# Altium project 1819_Emmeteur_DCF.PrjPCB
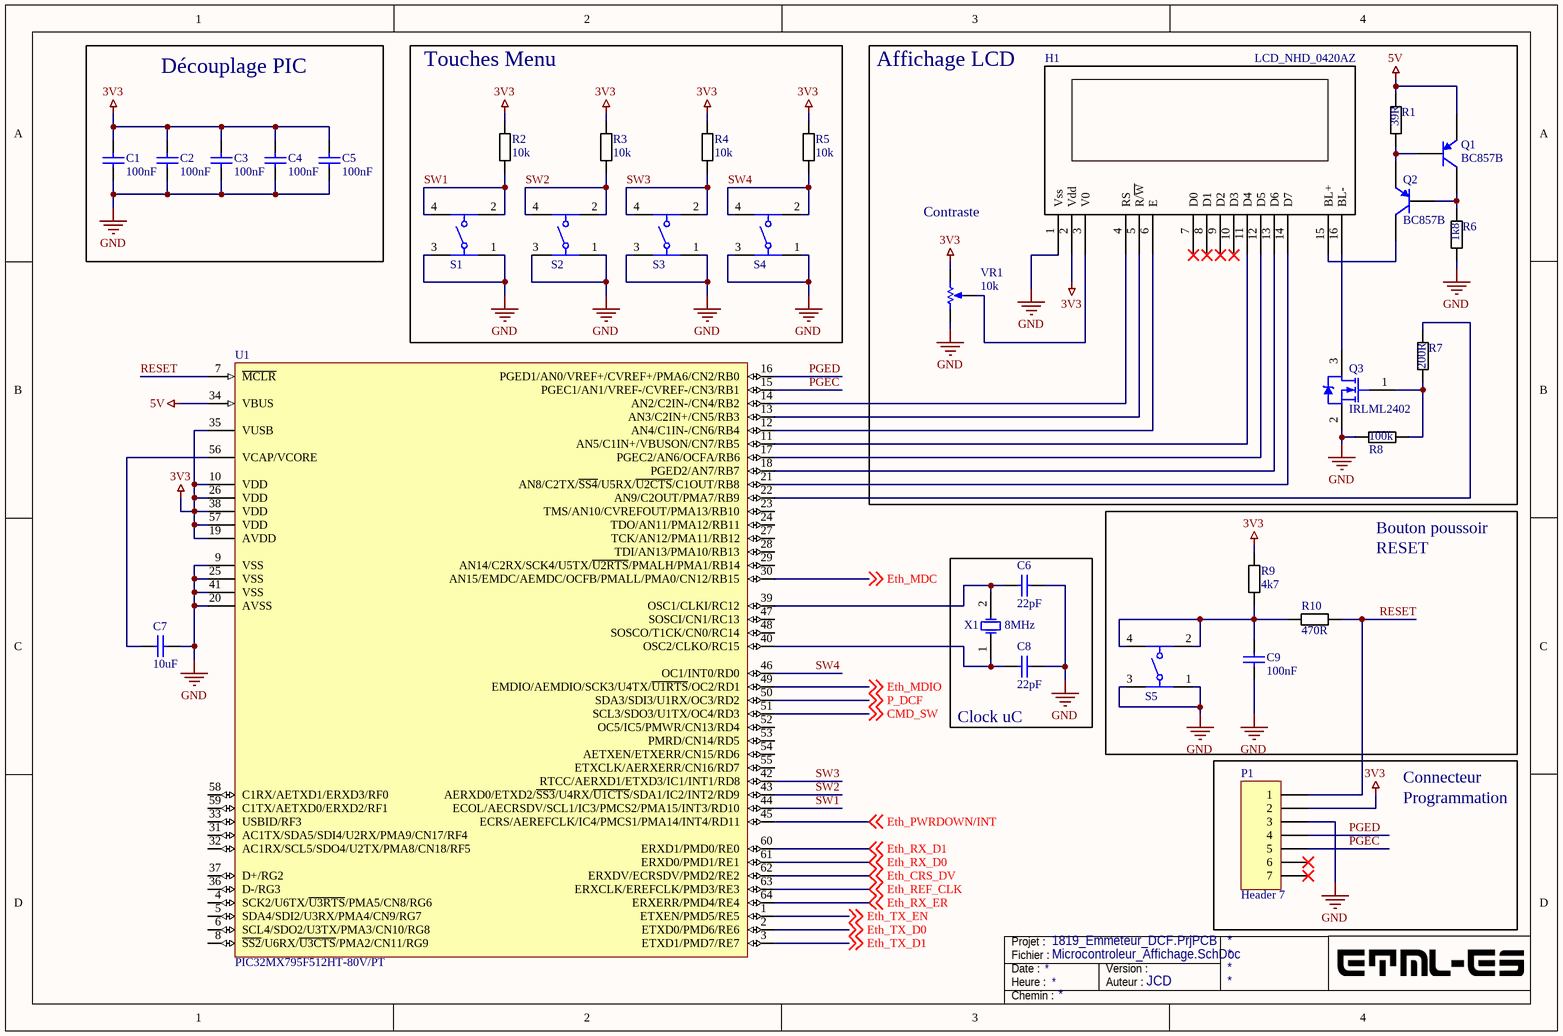
[diagram p0: Microcontroleur_Affichage.SchDoc]
2 sheets, 69 parts. Net scope: global (net labels, ports and power ports of the same name join across sheets).
Board file: 1819_Emmeteur_DCF.PcbDoc
Sheets:
  Microcontroleur_Affichage.SchDoc
  DCF_ALIM_SWITCH_RESET.SchDoc

## Sheet Microcontroleur_Affichage.SchDoc
size A4; Author: JCD

### Parts
C1  100nF  [C0805]
C2  100nF  [C0805]
C3  100nF  [C0805]
C4  100nF  [C0805]
C5  100nF  [C0805]
C6  22pF  [C0805]
C7  10uF  [C0805]
C8  22pF  [C0805]
C9  100nF  [C0805]
H1  LCD_NHD_0420AZ  [NHD-0420AZ-FSW-GBW-33V3]
P1  Header 7  [HDR1X7]
Q1  BC857B  [INF-SOT23_L]
Q2  BC857B  [INF-SOT23_L]
Q3  IRLML2402  [INTR-IRLML2402TRPBF-3_V]
R1  39R  [RESC0805(2012)_L]
R2  10k  [RESC0805(2012)_L]
R3  10k  [RESC0805(2012)_L]
R4  10k  [RESC0805(2012)_L]
R5  10k  [RESC0805(2012)_L]
R6  1k8  [RESC0805(2012)_L]
R7  200R  [RESC0805(2012)_L]
R8  100k  [RESC0805(2012)_L]
R9  4k7  [RESC0805(2012)_L]
R10  470R  [RESC0805(2012)_L]
S1  430152095836  [430152095836]  (value not drawn)
S2  430152095836  [430152095836]  (value not drawn)
S3  430152095836  [430152095836]  (value not drawn)
S4  430152095836  [430152095836]  (value not drawn)
S5  430152043836  [430152043836]  (value not drawn)
U1  PIC32MX795F512HT-80V/PT  [TQFP-PT64_L]
VR1  10k  [BOUR-3362P]
X1  8MHz  [ECS-80-18-5PX-TR_V]

### Blocks framed on the sheet
Découplage PIC: C1-C5
Touches Menu: R2-R5 S1-S4
Affichage LCD: H1 Q1-Q3 R1 R6-R8 VR1
Clock uC: C6 C8 X1

### Nets
3V3: C1.2 C2.2 C3.2 C4.2 C5.2 H1.2(Vdd) P1.2 R2.1 R3.1 R4.1 R5.1 R9.1 U1.10(VDD) U1.19(AVDD) U1.26(VDD) U1.35(VUSB) U1.38(VDD) U1.57(VDD) VR1.3(CW)
5V: Q1.2(E) R1.2 U1.34(VBUS)
GND: C1.1 C2.1 C3.1 C4.1 C5.1 C6.2 C7.2 C8.2 C9.1 H1.1(Vss) P1.3 Q3.2(S) R6.1 R8.1 S1.1 S1.3 S2.1 S2.3 S3.1 S3.3 S4.1 S4.3 S5.1 S5.3 U1.9(VSS) U1.20(AVSS) U1.25(VSS) U1.41(VSS) VR1.1(CCW)
CMD_SW: U1.51(SCL3/SDO3/U1TX/OC4/RD3) ; off-sheet CMD_SW
Eth_CRS_DV: U1.62(ERXDV/ECRSDV/PMD2/RE2) ; off-sheet Eth_CRS_DV
Eth_MDC: U1.30(AN15/EMDC/AEMDC/OCFB/PMALL/PMA0/CN12/RB15) ; off-sheet Eth_MDC
Eth_MDIO: U1.49(EMDIO/AEMDIO/SCK3/U4TX/~{U1RTS}/OC2/RD1) ; off-sheet Eth_MDIO
Eth_PWRDOWN/INT: U1.45(ECRS/AEREFCLK/IC4/PMCS1/PMA14/INT4/RD11) ; off-sheet Eth_PWRDOWN/INT
Eth_REF_CLK: U1.63(ERXCLK/EREFCLK/PMD3/RE3) ; off-sheet Eth_REF_CLK
Eth_RX_D0: U1.61(ERXD0/PMD1/RE1) ; off-sheet Eth_RX_D0
Eth_RX_D1: U1.60(ERXD1/PMD0/RE0) ; off-sheet Eth_RX_D1
Eth_RX_ER: U1.64(ERXERR/PMD4/RE4) ; off-sheet Eth_RX_ER
Eth_TX_D0: U1.2(ETXD0/PMD6/RE6) ; off-sheet Eth_TX_D0
Eth_TX_D1: U1.3(ETXD1/PMD7/RE7) ; off-sheet Eth_TX_D1
Eth_TX_EN: U1.1(ETXEN/PMD5/RE5) ; off-sheet Eth_TX_EN
P_DCF: U1.50(SDA3/SDI3/U1RX/OC3/RD2) ; off-sheet P_DCF
PGEC: P1.5 U1.15(PGEC1/AN1/VREF-/CVREF-/CN3/RB1)
PGED: P1.4 U1.16(PGED1/AN0/VREF+/CVREF+/PMA6/CN2/RB0)
RESET: P1.1 R10.2 U1.7(~{MCLR})
SW1: R2.2 S1.2 S1.4 U1.44(ECOL/AECRSDV/SCL1/IC3/PMCS2/PMA15/INT3/RD10)
SW2: R3.2 S2.2 S2.4 U1.43(AERXD0/ETXD2/~{SS3}/U4RX/~{U1CTS}/SDA1/IC2/INT2/RD9)
SW3: R4.2 S3.2 S3.4 U1.42(RTCC/AERXD1/ETXD3/IC1/INT1/RD8)
SW4: R5.2 S4.2 S4.4 U1.46(OC1/INT0/RD0)
NetC6_1: C6.1 U1.39(OSC1/CLKI/RC12) X1.2(X2)
NetC7_1: C7.1 U1.56(VCAP/VCORE)
NetC8_1: C8.1 U1.40(OSC2/CLKO/RC15) X1.1(X1)
NetC9_2: C9.2 R9.2 R10.1 S5.2 S5.4
NetH1_3: H1.3(V0) VR1.2(S)
NetH1_4: H1.4(RS) U1.14(AN2/C2IN-/CN4/RB2)
NetH1_5: H1.5(R/~{W}) U1.13(AN3/C2IN+/CN5/RB3)
NetH1_6: H1.6(E) U1.12(AN4/C1IN-/CN6/RB4)
NetH1_11: H1.11(D4) U1.11(AN5/C1IN+/VBUSON/CN7/RB5)
NetH1_12: H1.12(D5) U1.17(PGEC2/AN6/OCFA/RB6)
NetH1_13: H1.13(D6) U1.18(PGED2/AN7/RB7)
NetH1_14: H1.14(D7) U1.21(AN8/C2TX/~{SS4}/U5RX/~{U2CTS}/C1OUT/RB8)
NetH1_15: H1.15(BL+) Q2.3(C)
NetH1_16: H1.16(BL-) Q3.3(D)
NetQ1_1: Q1.1(B) Q2.2(E) R1.1
NetQ1_3: Q1.3(C) Q2.1(B) R6.2
NetQ3_1: Q3.1(G) R7.1 R8.2
NetR7_2: R7.2 U1.22(AN9/C2OUT/PMA7/RB9)

Not connected (* = marked no-connect by the designer): H1 7(D0)* 8(D1)* 9(D2)* 10(D3)*; P1 6* 7*; U1 4(SCK2/U6TX/~{U3RTS}/PMA5/CN8/RG6) 5(SDA4/SDI2/U3RX/PMA4/CN9/RG7) 6(SCL4/SDO2/U3TX/PMA3/CN10/RG8) 8(~{SS2}/U6RX/~{U3CTS}/PMA2/CN11/RG9) 23(TMS/AN10/CVREFOUT/PMA13/RB10) 24(TDO/AN11/PMA12/RB11) 27(TCK/AN12/PMA11/RB12) 28(TDI/AN13/PMA10/RB13) 29(AN14/C2RX/SCK4/U5TX/~{U2RTS}/PMALH/PMA1/RB14) 31(AC1TX/SDA5/SDI4/U2RX/PMA9/CN17/RF4) 32(AC1RX/SCL5/SDO4/U2TX/PMA8/CN18/RF5) 33(USBID/RF3) 36(D-/RG3) 37(D+/RG2) 47(SOSCI/CN1/RC13) 48(SOSCO/T1CK/CN0/RC14) 52(OC5/IC5/PMWR/CN13/RD4) 53(PMRD/CN14/RD5) 54(AETXEN/ETXERR/CN15/RD6) 55(ETXCLK/AERXERR/CN16/RD7) 58(C1RX/AETXD1/ERXD3/RF0) 59(C1TX/AETXD0/ERXD2/RF1)

### Notes on the sheet
- Contraste
- Bouton poussoir
- RESET
- Connecteur
- Programmation
- Fichier :
- Date :
- Heure :
- Projet :
- Auteur :
- Version :
- Chemin :

### Library data of the parts
C1-C9 = Cap: Capacitor; Published: 8-Jun-2000; LatestRevisionDate: 17-Jul-2002; LatestRevisionNote: Re-released for DXP Platform.; PackageReference: RAD-0.3; Publisher: Altium Limited; PackageDescription: Radial Cap, Thru-Hole; 2 Leads; 0.3 in Pin Spacing
  C1-C5 C9: Value: 100nF
  C6 C8: Value: 22pF
  C7: Value: 10uF
H1 = NHD-0420AZ-FSW-GBW-33V3
P1 = Header 7: Header, 7-Pin; LatestRevisionDate: 17-Jul-2002; LatestRevisionNote: Re-released for DXP Platform.; Publisher: Altium Limited
Q1 Q2 = CMP-1177-00036-1: PNP Silicon AF Transistor, 45 V VCEO, 100 mA IC, SOT23, Reel, Green; Manufacturer: Infineon; Ptot (max): 330Â mW; fT (typ): 250Â MHz; VCBO (max): 50Â V; ICM (max): 200Â mA; Green: TRUE; VCEO (max): 45Â V; VEBO (max): 5Â V; ICBO (max): 15Â nA; IC (max): 100Â mA; ComponentLink2Description: Datasheet; PartNumber: BC857B; PackageReference: SOT23; ComponentLink1URL: http://www.infineon.com/; IBM (max): 200Â mA; PackageDescription: 3-Pin Small Outline Transistor Package, 1.3 x 2.9 mm Body, 0.95 mm Pitch; ComponentLink3URL: http://www.infineon.com/dgdl/SOT23-Package_Overview.pdf?folderId=db3a30431936bc4b0119532290053c66&fileId=db3a30431936bc4b0119533468123c85; ComponentLink3Description: Package Specification; Mounting Technology: Surface Mount; ComponentLink1Description: Manufacturer URL; PackageVersion: Apr-08; Polarity: PNP; ComponentLink2URL: http://www.infineon.com/dgdl/bc857series_bc858series_bc859series_bc860series.pdf?folderId=db3a304314dca389011541d30fa21656&fileId=db3a304314dca389011541da0e3a1661; Packing: Reel
Q3 = CMP-2000-05155-1: HEXFET(R) Power MOSFET, N-Channel, 20 V, 1.2 A, 3-Pin SOT-23, RoHS, Tape and Reel; Manufacturer: International Rectifier; Voltage Vgs Rds on Measurement: 4.5V; Current Id Max: 1.2A; External Width: 3.05mm; Transistor Polarity: NChannel; No. of Pins: 3; Power Dissipation Pd: 540mW; External Length / Height: 1.12mm; Full Power Rating Temperature: 25degC; On Resistance Rds(on): 250mohm; Voltage Vds Typ: 20V; SMD Marking: 1A; No. of Transistors: 1; Reel Quantity: 3000; External Depth: 2.5mm; Pulse Current Idm: 7.4A; Junction Temperature Tj Min: -55degC; Threshold Voltage Vgs Typ: 700mV; SVHC: NoSVHC(19-Dec-2012); Datasheet URL: https://datasheet.ciiva.com/29326/162826-da-01-en-irlml-2402tr-29326791.pdf; Tape Width: 8mm; Operating Temperature Range: -55degCto+150degC; Manufacturer URL: http://internationalrectifier.com/; Termination Type: SMD; Datasheet Version: Jan-03; Current Temperature: 25degC; Package / Case: SOT-23; Drain Source Voltage Vds: 20V; Rds(on) Test Voltage Vgs: 4.5V; Continuous Drain Current Id: 1.2A; Transistor Case Style: SOT-23; Voltage Vgs th Min: 700mV; Voltage Vgs Max: 700mV
R1-R10 = Resistance
S1-S4 = 430152095836: 6x6mm SMD Tact Switch WS-TASV, height 9.5 mm, 360 gf; Rated Current: 50 mA; Operation Force: 360 gf; Rated Voltage: 12 VDC; ComponentLink1Description: Manufacturer; ComponentLink1URL: http://www.we-online.de; ComponentLink2Description: Datasheet; ComponentLink2URL: http://katalog.we-online.de/em/datasheet/4301x2xxx8x6.pdf; Part Number: 430152095836; Published Date: Nov. 2017; Publisher: Wurth Elektronik; Life Cycle: 200000; Operating Temperature: -40 to +85 degC; Size: 6x6x9.5 mm
S5 = 430152043836: 6x6mm SMD Tact Switch WS-TASV, height 4.3 mm, 360 gf; Rated Current: 50 mA; Operation Force: 360 gf; Rated Voltage: 12 VDC; ComponentLink1Description: Manufacturer; ComponentLink1URL: http://www.we-online.de; ComponentLink2Description: Datasheet; ComponentLink2URL: http://katalog.we-online.de/em/datasheet/4301x2xxx8x6.pdf; Part Number: 430152043836; Published Date: Nov. 2017; Publisher: Wurth Elektronik; Life Cycle: 200000; Operating Temperature: -40 to +85 degC; Size: 6x6x4.3 mm
U1 = CMP-0048-00370-1: High Performance 80 MHz MIPS-Based 32-Bit Flash Microcontroller with USB, CAN and Ethernet, 512KB Program Memory, 64-pin TQFP, V-Temp, Tape and Reel; DatasheetVersion: revG, May-2011; ComponentLink2URL: http://ww1.microchip.com/downloads/en/PackagingSpec/en012702.pdf; PackageDescription: 64-Lead Thin Plastic Quad Flat Pack (PT) - 10x10x1mm Body, 2.00mm [TQFP]; ComponentLink3URL: http://www.microchip.com/; ComponentLink1URL: http://ww1.microchip.com/downloads/en/DeviceDoc/61156G.pdf; Code_JEDEC: MS-026; ComponentLink2Description: Packaging Specification; ComponentLink3Description: Microchip.com Home; PackageVersion: revBB, Aug-2009; ComponentLink1Description: Datasheet; PackageReference: TQFP-PT64
VR1 = CMP-1747-00004-1: Square Trimpot(R) Trimming Potentiometer, 10 KOhm, 300 V, -55 to 125 degC, 3-Pin THD, RoHS, Tube; Voltage Rating: 220 mV; Power Rating: 1 W; Tolerance: 1%; Resistance: 50 mohm; Case/Package: 1206; Length: 3.2 mm; RoHSCompliant: True; PackageDescription: 3-Pin Through Hole Device, Body 6.6 x 6.99 mm, Pitch 2.54 mm; ComponentLink2Description: Datasheet; REACH SVHC: No SVHC; Mount: Surface Mount; Height: 0.6 mm; Packaging: Tape and Reel; ComponentLink1URL: http://www.bourns.com/; Case Code (Imperial): 0612; Pins: 2; Case Code (Metric): 1632; ComponentLink2URL: http://www.bourns.com/docs/Product-Datasheets/3362.pdf; Min Operating Temperature: -25degC; ComponentLink1Description: Manufacturer URL; PackageReference: 3326P; Max Operating Temperature: 125degC; Width: 1.6 mm; Package Quantity: 5000; DatasheetVersion: May-16
X1 = CMP-2000-06193-1: Low Profile Quartz Crystal, 8.0 MHz, 2-Pin SMD, RoHS, Tape and Reel; Brand: ECS; Tolerance: 30PPM; Case Height: 4.3mm; Frequency Stability: 50PPM; Case Length: 13.2mm; Case Width: 4.8mm; Load Capacitance: 18pF; Termination Style: SMD/SMT; Product Category: Crystals; Packaging: Reel; Package Reference: ECS-80-18-5PX-TR; Mounting Technology: SurfaceMount; Dimensions: 4.8mmWx13.2mmLx4.3mmH; Package Description: 2-Pin Surface Mount Device, Body 11.4 x 4.8 mm, Height 4.3 mm; Datasheet URL: https://www.ecsxtal.com/store/pdf/csm-7x.pdf; Datasheet Version: 05/2016; Frequency: 8MHz; Manufacturer: ECS; Factory Pack Quantity: 1000; Manufacturer URL: https://www.ecsxtal.com/; Type: SMDQuartzCrystals; Mounting Style: SMD/SMT; Package / Case: HC-49/US; Operating Temperature Range: -10Cto+70C; RoHS: Details; Series: CSM-7X

## Sheet DCF_ALIM_SWITCH_RESET.SchDoc
size A4; Author: JCD
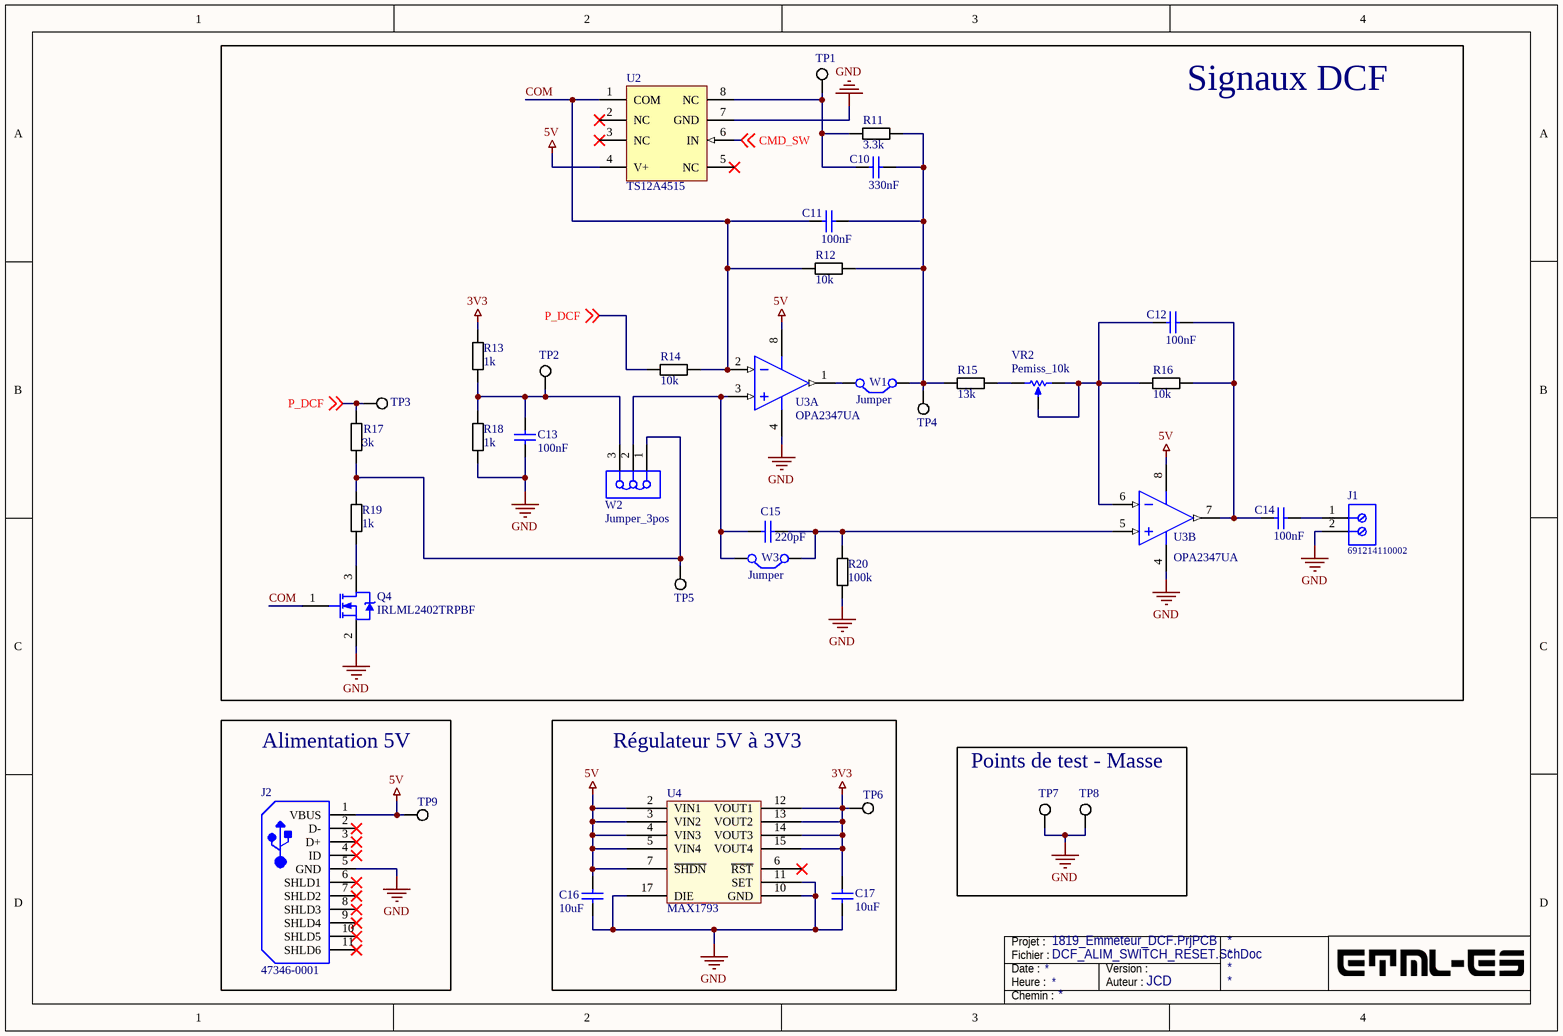
[diagram p1: DCF_ALIM_SWITCH_RESET.SchDoc]

### Parts
C10  330nF  [C0805]
C11  100nF  [C0805]
C12  100nF  [C0805]
C13  100nF  [C0805]
C14  100nF  [C0805]
C15  220pF  [C0805]
C16  10uF  [C0805]
C17  10uF  [C0805]
J1  691214110002  [691214110002]
J2  47346-0001  [MOLX-47346-0001-5_V]
Q4  IRLML2402TRPBF  [INTR-IRLML2402TRPBF-3_V]
R11  3.3k  [RESC0805(2012)_L]
R12  10k  [RESC0805(2012)_L]
R13  1k  [RESC0805(2012)_L]
R14  10k  [RESC0805(2012)_L]
R15  13k  [RESC0805(2012)_L]
R16  10k  [RESC0805(2012)_L]
R17  3k  [RESC0805(2012)_L]
R18  1k  [RESC0805(2012)_L]
R19  1k  [RESC0805(2012)_L]
R20  100k  [RESC0805(2012)_L]
TP1  5019  [KSTN-5019_V]  (value not drawn)
TP2  5019  [KSTN-5019_V]  (value not drawn)
TP3  5019  [KSTN-5019_V]  (value not drawn)
TP4  5019  [KSTN-5019_V]  (value not drawn)
TP5  5019  [KSTN-5019_V]  (value not drawn)
TP6  5019  [KSTN-5019_V]  (value not drawn)
TP7  5019  [KSTN-5019_V]  (value not drawn)
TP8  5019  [KSTN-5019_V]  (value not drawn)
TP9  5019  [KSTN-5019_V]  (value not drawn)
U2  TS12A4515  [TI-D8_L]
U3  OPA2347UA  [D0008A_M]  (parts A,B of 2)
U4  MAX1793  [MAX1793]
VR2  Pemiss_10k  [BOUR-3362P]
W1  Jumper  [Jumper_2POS]
W2  Jumper_3pos  [Jumper_3pos]
W3  Jumper  [Jumper_2POS]

### Blocks framed on the sheet
Signaux DCF: C10-C15 J1 Q4 R11-R20 TP1-TP5 U2 U3 VR2 W1-W3
Alimentation 5V: J2 TP9
Régulateur 5V à 3V3: C16 C17 TP6 U4
Points de test - Masse: TP7 TP8

### Nets
3V3: C17.2 R13.1 TP6.1 U4.12(VOUT1) U4.13(VOUT2) U4.14(VOUT3) U4.15(VOUT4)
5V: C16.2 J2.1(VBUS) TP9.1 U2.4(V+) U3.8(V+) U4.2(VIN1) U4.3(VIN2) U4.4(VIN3) U4.5(VIN4) U4.7(~{SHDN})
GND: C13.1 C16.1 C17.1 J1.2 J2.5(GND) Q4.2(S) R18.2 R20.2 TP7.1 TP8.1 U2.7(GND) U3.4(V-) U4.10(GND) U4.11(SET) U4.17(DIE)
CMD_SW: U2.6(IN) ; off-sheet CMD_SW
COM: C11.2 Q4.1(G) R12.1 R14.2 U2.1(COM) U3.2(IN_A-)
P_DCF: R14.1 R17.1 TP3.1 ; off-sheet P_DCF
NetC10_1: C10.1 C11.1 R11.2 R12.2 R15.1 TP4.1 W1.2(C2)
NetC10_2: C10.2 R11.1 TP1.1 U2.8(NC)
NetC12_1: C12.1 C14.2 R16.2 U3.7(OUT_B)
NetC12_2: C12.2 R16.1 U3.6(IN_B-) VR2.2(S) VR2.3(CW)
NetC13_2: C13.2 R13.2 R18.1 TP2.1 W2.3
NetC14_1: C14.1 J1.1
NetC15_1: C15.1 R20.1 U3.5(IN_B+) W3.2(C2)
NetC15_2: C15.2 U3.3(IN_A+) W2.2 W3.1(C1)
NetQ4_3: Q4.3(D) R19.2
NetR15_2: R15.2 VR2.1(CCW)
NetR17_2: R17.2 R19.1 TP5.1 W2.1
NetU3_1: U3.1(OUT_A) W1.1(C1)

Not connected (* = marked no-connect by the designer): J2 2(D-)* 3(D+)* 4(ID)* 6(SHLD1)* 7(SHLD2)* 8(SHLD3)* 9(SHLD4)* 10(SHLD5)* 11(SHLD6)*; U2 2(NC)* 3(NC)* 5(NC)*; U4 6(~{RST})*

### Notes on the sheet
- Fichier :
- Date :
- Heure :
- Projet :
- Auteur :
- Version :
- Chemin :

### Library data of the parts
C10-C17 = Cap: Capacitor; Published: 8-Jun-2000; LatestRevisionDate: 17-Jul-2002; LatestRevisionNote: Re-released for DXP Platform.; PackageReference: RAD-0.3; Publisher: Altium Limited; PackageDescription: Radial Cap, Thru-Hole; 2 Leads; 0.3 in Pin Spacing
  C10: Value: 330nF
  C11-C14: Value: 100nF
  C15: Value: 220pF
  C16 C17: Value: 10uF
J1 = 691214110002: Serie 2141 - 3.50 mm Horizontal Entry Modular with Rising Cage Clamp WR-TBL, 2 pin; Pin Number: 2; Pitch: 3.50 mm; ComponentLink1Description: Manufacturer; ComponentLink1URL: http://www.we-online.de; ComponentLink2Description: Datasheet; ComponentLink2URL: http://katalog.we-online.de/em/datasheet/6912141100xx.pdf; Part Number: 691214110002; Published Date: June 2018; Publisher: Wurth Elektronik; Operating Temperature: -40 to 105 degC; Mounting Technology: THT; Packaging: Box
J2 = CMP-2000-05246-1: Micro-USB B Receptacle with Flange, -30 to 85 degC, 5-Pin SMD, RoHS, Tape and Reel; Manufacturer: Molex; Number of Contacts: 5; Body Orientation: RightAngle; Maximum Voltage Rating: 30VAC; Pitch: 0.65mm; Maximum Current Rating: 1.8/ContactA; Number of Ports: 1; Gender: RCP; Operating Temperature: -30to85C; Part No: 47346-0001; Color: Black; Termination Method: Solder; Contact Plating: GoldOverPalladiumNickelOverNickel; Dimension: 7.8x5.43x2.94mm; Number of Terminals: 5; Datasheet Version: Dec-13; Datasheet URL: https://datasheet.ciiva.com/30075/304740473460001-io-nectors-30075527.pdf; Contact Material: CopperAlloy; RoHS: Yes; Housing Material: LiquidCrystalPolymer; Manufacturer URL: http://www.molex.com/; Packaging: EmbossedTapeandReel; Mounting: SurfaceMount; Type: MicroUSBTypeB
Q4 = CMP-2000-05155-1: as Q3 on sheet Microcontroleur_Affichage; Datasheet URL: https://datasheet.ciiva.com/29326/162826-da-01-en-irlml-2402tr-29326791.pdf; Tape Width: 8mm; Operating Temperature Range: -55degCto+150degC; Manufacturer URL: http://internationalrectifier.com/; Termination Type: SMD; Datasheet Version: Jan-03; Current Temperature: 25degC; Package / Case: SOT-23; Drain Source Voltage Vds: 20V; Rds(on) Test Voltage Vgs: 4.5V; Continuous Drain Current Id: 1.2A; Transistor Case Style: SOT-23; Voltage Vgs th Min: 700mV; Voltage Vgs Max: 700mV
R11-R20 = Resistance
TP1-TP9 = CMP-1672-00008-1: Test Point, 1 Position SMD, RoHS, Tape and Reel; ComponentLink1Description: Manufacturer URL; Package Quantity: 1000; DatasheetVersion: 03/2014; Packaging: Tape and Reel; ComponentLink2URL: http://www.keyelco.com/product-pdf.cfm?p=1357; ComponentLink1URL: http://www.keyelco.com/; Mount: Surface Mount; Contact Plating: Silver; PackageDescription: 1-Pin Surface Mount Device, Body 3.81 x 2.03 mm; Pins: 1; RoHSCompliant: True; Mounting Technology: Surface Mount; ComponentLink2Description: Datasheet; PackageReference: 5019
U2 = TS12A4515: Dual Supply, Low On-State Resistance SPST CMOS Analog Switch, -40 to 85 degC, 8-Pin SOIC (D8), RoHS, Tube; Manufacturer: Texas Instruments; PartNumber: TS12A4516D; Channels: 1; Ron: 25 Ohm Max.; PackageDescription: 8-Pin Plastic Small Outline, Body 4.9 x 3.9 mm, Pitch 1.27 mm; ComponentLink1URL: http://www.ti.com/; Packing: Tube; ComponentLink2Description: Datasheet; PackageVersion: 4040047-3/M; Switch Configuration: SPST; ComponentLink1Description: Manufacturer URL; DatasheetVersion: SCDS236B; Temperature Range: -40 to 85 degC; ComponentLink3Description: Package Specification; PackageReference: D0008A; ComponentLink3URL: http://www.ti.com/lit/ml/msoi002j/msoi002j.pdf; RoHS: TRUE; ComponentLink2URL: http://www.ti.com/lit/ds/symlink/ts12a4516.pdf; Mounting Technology: Surface Mount
U3 = CMP-0272-00425-3: MicroPower, Rail-to-Rail Operational Amplifier, 2.3 to 5.5 V, -55 to 125 degC, 8-pin SOIC (D8), Green (RoHS & no Sb/Br); Manufacturer: Texas Instruments; Number of Channels: 2; Rating: Catalog; Sub Family: Low Input Bias Current Amp (<=10pA), Low Power Amp (<=500uA), Low Supply Voltage Amplifier (<=2.7V), Precision Amplifier; GBW(Typ)(MHz): 0.35; Iq per channel(Max)(mA): 0.034; Packing: TUBE; Total Supply Voltage(Min)(+5V is 5, +/-5V is 10): 2.3; Offset Drift(Typ)(uV/C): 3; IIB(Max)(pA): 10; Total Supply Voltage(Max)(+5V is 5, +/-5V is 10): 5.5; Slew Rate(Typ)(V/us): 0.17; CMRR(Min)(dB): 70; Vio (25C)(Max)(mV): 6; PackageVersion: 4040047-3/M, 06/2011; ComponentLink3Description: Package Specification; ComponentLink2Description: Datasheet; ComponentLink2URL: http://www.ti.com/lit/ds/symlink/opa2347.pdf; Mounting Technology: Surface Mount; ComponentLink3URL: http://www.ti.com/litv/pdf/msoi002j; PackageReference: D0008A; DatasheetVersion: SBOS167D; ComponentLink1Description: Manufacturer URL; ComponentLink1URL: http://www.ti.com/; Eco-Plan: Green (RoHS & no Sb/Br); Code_JEDEC: MS-012; PartNumber: OPA2347UA; PackageDescription: 8-Pin Plastic Small Outline, Body 4.9 x 3.9 mm, Pitch 1.27 mm
VR2 = CMP-1747-00004-1: as VR1 on sheet Microcontroleur_Affichage; Case/Package: 1206; Length: 3.2 mm; RoHSCompliant: True; PackageDescription: 3-Pin Through Hole Device, Body 6.6 x 6.99 mm, Pitch 2.54 mm; ComponentLink2Description: Datasheet; REACH SVHC: No SVHC; Mount: Surface Mount; Height: 0.6 mm; Packaging: Tape and Reel; ComponentLink1URL: http://www.bourns.com/; Case Code (Imperial): 0612; Pins: 2; Case Code (Metric): 1632; ComponentLink2URL: http://www.bourns.com/docs/Product-Datasheets/3362.pdf; Min Operating Temperature: -25degC; ComponentLink1Description: Manufacturer URL; PackageReference: 3326P; Max Operating Temperature: 125degC; Width: 1.6 mm; Package Quantity: 5000; DatasheetVersion: May-16
W1 W3 = Jumper: Jumper Wire; Published: 24-Mar-1999; LatestRevisionDate: 17-Jul-2002; LatestRevisionNote: Re-released for DXP Platform.; PackageReference: RAD-0.2; Publisher: Altium Limited; PackageDescription: Radial Cap, Thru-Hole; 2 Leads; 0.2 in Pin Spacing

## Nets that join several sheets
3V3: Microcontroleur_Affichage (19 pins), DCF_ALIM_SWITCH_RESET (7 pins)
5V: Microcontroleur_Affichage (Q1.2 R1.2 U1.34), DCF_ALIM_SWITCH_RESET (10 pins)
GND: Microcontroleur_Affichage (29 pins), DCF_ALIM_SWITCH_RESET (15 pins)
CMD_SW: Microcontroleur_Affichage (U1.51), DCF_ALIM_SWITCH_RESET (U2.6)
P_DCF: Microcontroleur_Affichage (U1.50), DCF_ALIM_SWITCH_RESET (R14.1 R17.1 TP3.1)